# Altium schematic sheet Accumulator_Register.SchDoc
size B; Author: E. Sims; Organization: Let's Build Rockets Inc.; SheetNumber: 2; SheetTotal: 16
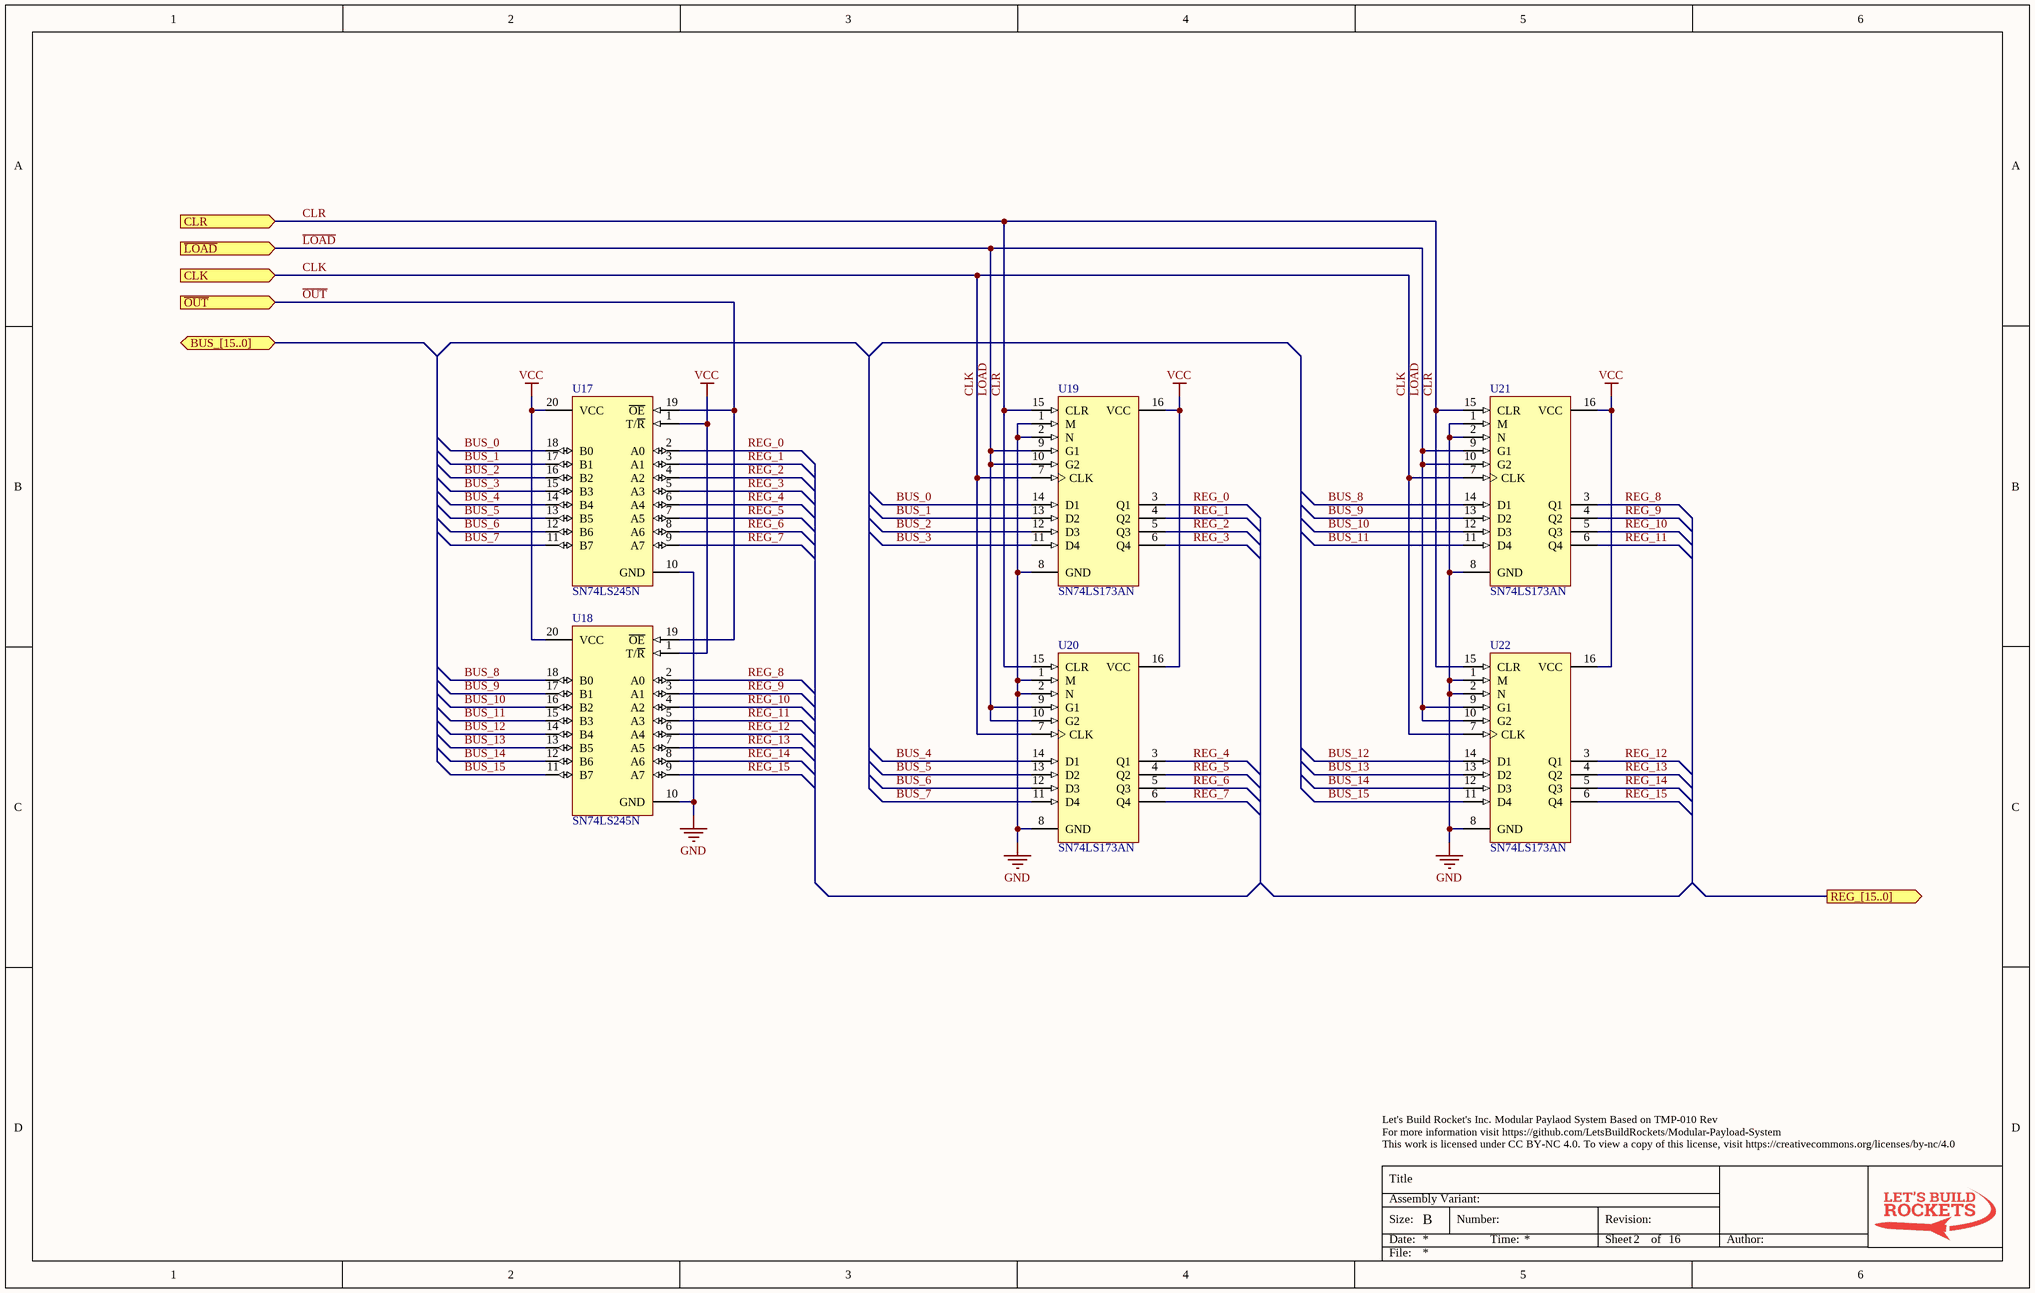
[diagram p0: Accumulator_Register.SchDoc]

## Parts
U17  SN74LS245N  [N020]
U18  SN74LS245N  [N020]
U19  SN74LS173AN  [N016D]
U20  SN74LS173AN  [N016D]
U21  SN74LS173AN  [N016D]
U22  SN74LS173AN  [N016D]

## Ports
BUS_[15..0] (bidir), CLK (in), CLR (in), REG_[15..0] (out), ~{LOAD} (in), ~{OUT} (in)

## Nets
GND: U17.10(GND) U18.10(GND) U19.1(M) U19.2(N) U19.8(GND) U20.1(M) U20.2(N) U20.8(GND) U21.1(M) U21.2(N) U21.8(GND) U22.1(M) U22.2(N) U22.8(GND)
VCC: U17.1(T/~{R}) U17.20(VCC) U18.1(T/~{R}) U18.20(VCC) U19.16(VCC) U20.16(VCC) U21.16(VCC) U22.16(VCC)
BUS_0: U17.18(B0) U19.14(D1)
BUS_1: U17.17(B1) U19.13(D2)
BUS_2: U17.16(B2) U19.12(D3)
BUS_3: U17.15(B3) U19.11(D4)
BUS_4: U17.14(B4) U20.14(D1)
BUS_5: U17.13(B5) U20.13(D2)
BUS_6: U17.12(B6) U20.12(D3)
BUS_7: U17.11(B7) U20.11(D4)
BUS_8: U18.18(B0) U21.14(D1)
BUS_9: U18.17(B1) U21.13(D2)
BUS_10: U18.16(B2) U21.12(D3)
BUS_11: U18.15(B3) U21.11(D4)
BUS_12: U18.14(B4) U22.14(D1)
BUS_13: U18.13(B5) U22.13(D2)
BUS_14: U18.12(B6) U22.12(D3)
BUS_15: U18.11(B7) U22.11(D4)
CLK: U19.7(CLK) U20.7(CLK) U21.7(CLK) U22.7(CLK) ; port CLK
CLR: U19.15(CLR) U20.15(CLR) U21.15(CLR) U22.15(CLR) ; port CLR
~{LOAD}: U19.9(G1) U19.10(G2) U20.9(G1) U20.10(G2) U21.9(G1) U21.10(G2) U22.9(G1) U22.10(G2) ; port ~{LOAD}
~{OUT}: U17.19(~{OE}) U18.19(~{OE}) ; port ~{OUT}
REG_0: U17.2(A0) U19.3(Q1)
REG_1: U17.3(A1) U19.4(Q2)
REG_2: U17.4(A2) U19.5(Q3)
REG_3: U17.5(A3) U19.6(Q4)
REG_4: U17.6(A4) U20.3(Q1)
REG_5: U17.7(A5) U20.4(Q2)
REG_6: U17.8(A6) U20.5(Q3)
REG_7: U17.9(A7) U20.6(Q4)
REG_8: U18.2(A0) U21.3(Q1)
REG_9: U18.3(A1) U21.4(Q2)
REG_10: U18.4(A2) U21.5(Q3)
REG_11: U18.5(A3) U21.6(Q4)
REG_12: U18.6(A4) U22.3(Q1)
REG_13: U18.7(A5) U22.4(Q2)
REG_14: U18.8(A6) U22.5(Q3)
REG_15: U18.9(A7) U22.6(Q4)

## Notes on the sheet
- Let's Build Rocket's Inc. Modular Paylaod System Based on TMP-010 Rev
  For more information visit https://github.com/LetsBuildRockets/Modular-Payload-System
  This work is licensed under CC BY-NC 4.0. To view a copy of this license, visit https://creativecommons.org/licenses/by-nc/4.0
- Title
- Size:
- Date:
- Assembly Variant:
- B
- Number:
- Time:
- Revision:
- Sheet
- of
- Author:
- File:

## Library data of the parts
U17 U18 = SN74LS245N: Octal Bus Transceiver with 3-State Outputs; Published: 8-Jun-2000; LatestRevisionDate: 04-Mar-2005; LatestRevisionNote: Stylized 3D Model Added.; DatasheetVersion: Mar-1988; PackageVersion: Oct-1995; PackageReference: N020; Publisher: Altium Limited; PackageDescription: DIP; 20 Leads; Row Spacing 7.62 mm; Pitch 2.54 mm; ComponentLink1Description: Manufacturer Link; ComponentLink1URL: http://www.ti.com/; ComponentLink2Description: Datasheet; ComponentLink2URL: http://www-s.ti.com/sc/ds/sn74ls245.pdf
U19-U22 = SN74LS173AN: 4-Bit D-Type Register with 3-State Outputs; Published: 8-Jun-2000; LatestRevisionDate: 04-Mar-2005; LatestRevisionNote: Stylized 3D Model Added.; DatasheetVersion: Mar-1988; PackageVersion: Oct-1995; PackageReference: N016D; Publisher: Altium Limited; PackageDescription: DIP; 16 Leads; Row Spacing 7.62 mm; Pitch 2.54 mm; Code_JEDEC: MS-001-BB; ComponentLink1Description: Manufacturer Link; ComponentLink1URL: http://www.ti.com/; ComponentLink2Description: Datasheet; ComponentLink2URL: http://www-s.ti.com/sc/ds/sn74ls173a.pdf